# Altium schematic sheet LTC2499Test.SchDoc
size A
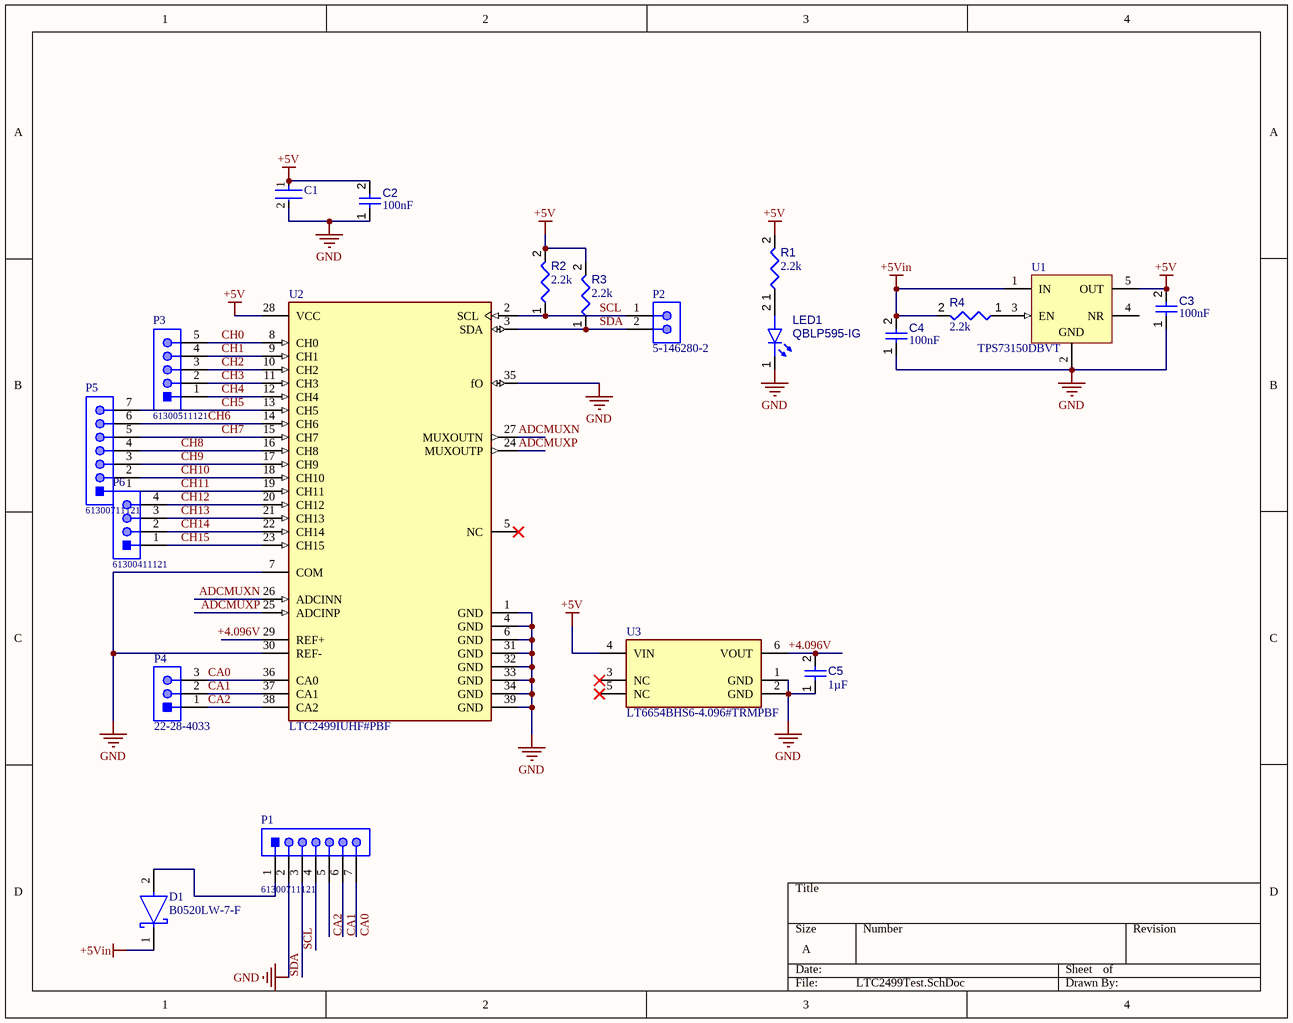
[diagram p0: LTC2499Test.SchDoc]

## Parts
C1  GRM21BR60J226ME39L  [FP-GRM21B-0_15-MFG]  (value not drawn)
C2  value 100nF  [CAPC0402(1005)60_L]  (hidden comment: Capacitor 100nF +/-20% 25V 0402)
C3  value 100nF  [CAPC0402(1005)60_L]  (hidden comment: Capacitor 100nF +/-20% 25V 0402)
C4  value 100nF  [CAPC0402(1005)60_L]  (hidden comment: Capacitor 100nF +/-20% 25V 0402)
C5  value 1µF  [CAPC1608X90X35ML15T15]  (hidden comment: Capacitor 1uF +/- 10% 16V 0603)
D1  B0520LW-7-F  [FP-SOD123-MFG]
LED1  QBLP595-IG  [QTB-QBLP595_V]
P1  61300711121  [61300711121]
P2  5-146280-2  [TECO-5-146280-2_V]
P3  61300511121  [61300511121]
P4  22-28-4033  [MOLX-22-28-4033_V]
P5  61300711121  [61300711121]
P6  61300411121  [61300411121]
R1  value 2.2k  [RESC0402(1005)_L]  (hidden comment: Resistor 2K2  +/-5 % 0402 63 mW)
R2  value 2.2k  [RESC0402(1005)_L]  (hidden comment: Resistor 2K2  +/-5 % 0402 63 mW)
R3  value 2.2k  [RESC0402(1005)_L]  (hidden comment: Resistor 2K2  +/-5 % 0402 63 mW)
R4  value 2.2k  [RESC0402(1005)_L]  (hidden comment: Resistor 2K2  +/-5 % 0402 63 mW)
U1  TPS73150DBVT  [DBV0005A_N]
U2  LTC2499IUHF#PBF  [FP-UHF-38-05-08-1701-IPC_C]
U3  LT6654BHS6-4.096#TRMPBF  [FP-S6-6-05-08-1636-IPC_B]

## Nets
+5V: C1.1 C2.2 C3.2 R1.2 R2.2 R3.2 U1.5(OUT) U2.28(VCC) U3.4(VIN)
+5Vin: C4.2 D1.1(C) R4.2 U1.1(IN)
GND: C1.2 C2.1 C3.1 C4.1 C5.1 LED1.1(K) P1.2 U1.2(GND) U2.1(GND) U2.4(GND) U2.6(GND) U2.7(COM) U2.30(REF-) U2.31(GND) U2.32(GND) U2.33(GND) U2.34(GND) U2.35(fO) U2.39(GND) U3.1(GND) U3.2(GND)
+4.096V: C5.2 U2.29(REF+) U3.6(VOUT)
ADCMUXN: U2.26(ADCINN) U2.27(MUXOUTN)
ADCMUXP: U2.24(MUXOUTP) U2.25(ADCINP)
CA0: P1.7 P4.3 U2.36(CA0)
CA1: P1.6 P4.2 U2.37(CA1)
CA2: P1.5 P4.1 U2.38(CA2)
CH0: P3.5 U2.8(CH0)
CH1: P3.4 U2.9(CH1)
CH2: P3.3 U2.10(CH2)
CH3: P3.2 U2.11(CH3)
CH4: P3.1 U2.12(CH4)
CH5: P5.7 U2.13(CH5)
CH6: P5.6 U2.14(CH6)
CH7: P5.5 U2.15(CH7)
CH8: P5.4 U2.16(CH8)
CH9: P5.3 U2.17(CH9)
CH10: P5.2 U2.18(CH10)
CH11: P5.1 U2.19(CH11)
CH12: P6.4 U2.20(CH12)
CH13: P6.3 U2.21(CH13)
CH14: P6.2 U2.22(CH14)
CH15: P6.1 U2.23(CH15)
SCL: P1.4 P2.1 R2.1 U2.2(SCL)
SDA: P1.3 P2.2 R3.1 U2.3(SDA)
NetD1_2: D1.2(A) P1.1
NetLED1_2: LED1.2(A) R1.1
NetR4_1: R4.1 U1.3(EN)

Not connected (* = marked no-connect by the designer): U1 4(NR); U2 5(NC)*; U3 3(NC)* 5(NC)*

## Library data of the parts
C1 = CMP-2007-03385-2: Chip Multilayer Ceramic Capacitors for General Purpose, 0805, 22uF, X5R, 15%, 20%, 6.3V; Material: Ceramic; Max Operating Temperature: 85°C; Voltage: 6.3V; Min Operating Temperature: -55°C; Case/Package: 0805; Thickness: 0.053inch; Dielectric: X5R; Packaging: Tape and Reel; Depth: 1.25mm; Termination: SMD/SMT; Voltage Rating (DC): 6.3V; Radiation Hardening: No; Tolerance: 20%; Mount: Surface Mount; Lead Free: Lead Free; Package Quantity: 1; REACH SVHC: No SVHC; Voltage Rating: 6.3V; Capacitance: 22uF; Length: 2mm; Case Code (Imperial): 0805; Case Code (Metric): 2012; Width: 0.049inch; Height: 1.25mm
C2-C4 = CMP-001-00065-4: Chip Capacitor, 100nF +/-20%, 25V, 0402, Thickness 0.6 mm; Tolerance: 10%; Max Operating Temperature: 85°C; Min Operating Temperature: -55°C; Pins: 2; Voltage Rating: 25V; Mounting Technology: SMT; Case/Package: 0402
C5 = CMP-001-00004-6: Chip Capacitor, 1 uF, +/- 10%, 16 V, 0603 (1608 Metric); Capacitor Type: Ceramic; Mounting Technology: SM; RoHS Compliant: True; Min Operating Temperature: -55°C; Case/Package: 0603; Pins: 2; Voltage Rating: 16V; Max Operating Temperature: 125°C; Tolerance: 10%
D1 = CMP-12790-000026-1: DIODE SCHOTTKY 20V 500MA SOD123; Manufacturer: Diodes Inc.; Max Junction Temp: +125°C; Value: 170pF; Max Surge Forward Current: 5.5A; Forward Current: 0.5A; Standoff Height: 0mm; Peak Reverse Current: 250uA; Octopart: https://octopart.com/b0520lw-7-f-diodes+inc.-325707; Mouser Description: Schottky Diodes & Rectifiers 20V 410mW; ComponentLink2Description: Datasheet; Ipc Land Pattern Name: SOD365155X123-2; Device Class L1: Discrete Semiconductors; Category: Diode; ComponentLink2URL: https://www.diodes.com/assets/Datasheets/ds30051.pdf; Footprint Url: https://www.diodes.com/assets/Package-Files/SOD123.pdf; Package: SOD123; Device Class L3: Schottky Diodes; Digikey Description: DIODE SCHOTTKY 20V 500MA SOD123; Temperature Range Low: -65°C; RoHS: TRUE; Max Repetitive Reverse Voltage: 20V; Lead Free: Yes; Temperature: -65°C to +125°C; Reverse Voltage: 20V; Temperature Range High: +125°C; Capacitance: 170pF; Device Class L2: Diodes; Automotive: No; Height: 1.45mm; Manufacturer Part Number: B0520LW-7-F
LED1 = CMP-007-00041-3: Chip LED 0402, Green, 0.02 A, 3.1 to 3.7 V, -40 to 80 degC, 2-Pin SMD, RoHS, Tape and Reel; Case/Package: 0402; Colour: Green; Mounting Technology: SMT; Pins: 2; RoHS Compliant: Yes
P1 P5 = CMP-1502-01074-1: THT Vertical Pin Header WR-PHD, Pitch 2.54 mm, Single Row, 7 pins; Manufacturer: Wurth Elektronik; Pin Number: 7; Gender: Male; Working Voltage: 250VAC; Contact Resistance: 20mOhm; Rated Current: 3A; Pitch: 2.54mm; Withstanding Voltage: 500VAC; Row Number: Single; Packaging: Bag; Orientation: Vertical; Manufacturer URL: http://www.we-online.de; Datasheet URL: https://katalog.we-online.de/em/datasheet/6130xx11121.pdf; Part Number: 61300711121; Publisher: WurthElektronik; Operating Temperature: -40to105degC; Mounting Technology: THT; Package Reference: 61300711121
P2 = CMP-2000-07492-1: Male Header, Pitch 2.54 mm, 1 x 2 Position, Height 8.21 mm, Tail Length 3.05 mm, -65 to 105 degC, RoHS, Bulk; Manufacturer: TE Connectivity; Mating Connector Lock: No(Without); Number of Positions: 2; Pitch: 2.54mm; PCB Mounting Orientation: Vertical; Keyed: No; Case\/Package: 100; Mating Post Length: 0.23inch; High Temperature Housing: Yes; Max Current Rating: 5A; PCB Thickness: 0.063inch; PCB Mount Retention: Without; Approvals: CSA; Current Rating: 3A; Radiation Hardening: No; Length: 4.67mm; Contact Mating Length: 0.23inch; Connector Type: Header; Number of Rows: 1; Termination Post Length: 0.12inch; Board Standoff: No(Without); Max Operating Temperature: 105degC; Contact Shape: Square; Selectively Loaded: No(Without); Gasket: No(Without); Number of Contacts: 2; Contact Gender: Male; Mating Alignment: No(Without); Manufacturer URL: http://www.te.com/; Datasheet URL: http://www.te.com/commerce/DocumentDelivery/DDEController?Action=showdoc&DocId=Customer+Drawing%7F146280%7FH1%7Fpdf%7FEnglish%7FENG_CD_146280_H1.pdf%7F5-146280-2; Mount: ThroughHole; Orientation: Straight; Packaging: Carton; Package Reference: 5-146280-2; Package Quantity: 500; Stabilizers: No(Without); Row Spacing: 2.54mm; Contact Material: CopperAlloy; Panel Mount Retention: No(Without); Datasheet Version: Rev. H1, 08/2016; Housing Colour: Black; Colour: Black; Package Description: Male Header, Pitch 2.54 mm, 1 x 2 Position, Height 8.21 mm, Tail Length 3.05 mm; Contact Plating: Matte; Housing Material: Polymer; Contact Protection: No(Without); Min Operating Temperature: -65degC; Mounting Technology: ThroughHole; Flammability Rating: UL94V-0; RoHSCompliant: true; Termination: ThroughHole; Depth: 2.34mm; High Speed Serial Data Connector: No
P3 = CMP-1502-01068-1: THT Vertical Pin Header WR-PHD, Pitch 2.54 mm, Single Row, 5 pins; Manufacturer: Wurth Elektronik; Pin Number: 5; Contact Resistance: 20mOhm; Working Voltage: 250VAC; Pitch: 2.54mm; Withstanding Voltage: 500VAC; Rated Current: 3A; Gender: Male; Datasheet URL: https://katalog.we-online.de/em/datasheet/6130xx11121.pdf; Orientation: Vertical; Mounting Technology: THT; Row Number: Single; Package Reference: 61300511121; Publisher: WurthElektronik; Part Number: 61300511121; Packaging: Bag; Manufacturer URL: http://www.we-online.de; Operating Temperature: -40to105degC
P4 = CMP-1676-00001-5: Male Header, Pitch 2.54 mm, 1 x 3 Position, Height 8.38 mm, Tail Length 3.18 mm, RoHS, Bulk; Manufacturer: Molex; Rows: 1; Voltage Rating: 250 V; Current Rating: 4 A; Min Operating Temperature: 0 degC; Lead Pitch: 0.1 inch; Packaging: Bulk; Contact Finish: Gold; RoHSCompliant: true; Contact Material: Brass; PackageReference: 22-28-4033; REACH SVHC: Unknown; PackageDescription: Male Header, Pitch 2.54 mm, 1 x 3 Position, Height 8.38 mm, Tail Length 3.18 mm; ComponentLink2URL: http://www.molex.com/pdm_docs/sd/022284033_sd.pdf; Height: 8.38 mm; Mounting Technology: Through Hole; ComponentLink1Description: Manufacturer URL; Length: 7.62 mm; Mount: Through Hole; DatasheetVersion: Rev. G, 01/2012; Max Operating Temperature: 75 degC; ComponentLink2Description: Datasheet; Colour: Black; Pins: 3; Contact Plating: Gold; Package Quantity: 1; ComponentLink1URL: http://www.molex.com/
P6 = CMP-1502-01064-1: THT Vertical Pin Header WR-PHD, Pitch 2.54 mm, Single Row, 4 pins; Manufacturer: Wurth Elektronik; Withstanding Voltage: 500VAC; Rated Current: 3A; Working Voltage: 250VAC; Pin Number: 4; Gender: Male; Contact Resistance: 20mOhm; Pitch: 2.54mm; Manufacturer URL: http://www.we-online.de; Operating Temperature: -40to105degC; Packaging: Bag; Mounting Technology: THT; Package Reference: 61300411121; Datasheet URL: https://katalog.we-online.de/em/datasheet/6130xx11121.pdf; Publisher: WurthElektronik; Part Number: 61300411121; Row Number: Single; Orientation: Vertical
R1-R4 = CMP-009-00166-3: Chip Resistor, 2,2 kOhms, +/-5 %, 63 mW, -55 to 155 degC, 0402; Power: 63mW; Tolerance: 5%; Pins: 2; Min Operating Temperature: -55°C; Max Operating Temperature: 155°C; Case/Package: 0402
U1 = CMP-0394-00654-2: Single Output Fast Transient Response LDO, 150 mA, Fixed 5 V Output, 1.7 to 5.5 V Input, 5-pin SOT-23 (DBV), -40 to 85 degC, Green (RoHS & no Sb/Br); Manufacturer: Texas Instruments; Vout Adj(Max)(V): 5; SubFamily: Single Channel LDO; Vdo(Typ)(mV): 30; Accuracy(%): 1; Vin(Max)(V): 5.5; Iout(Max)(A): 0.15; Vin(Min)(V): 1.7; Iq(Typ)(mA): 0.4; Eco-Plan: Green (RoHS & no Sb/Br); ComponentLink3URL: http://www.ti.com/litv/pdf/mpds018i; Code_JEDEC: MO-178; ComponentLink3Description: Package Specification; ComponentLink1Description: Manufacturer URL; ComponentLink2Description: Datasheet; PartNumber: TPS73150DBVT; ComponentLink1URL: http://www.ti.com/; PackageDescription: 5-Pin Plastic Small Outline, Body 1.60 Ãƒâ€” 2.90 mm, Pitch 0.95 mm; PackageVersion: 4073253-4/K; Vout Adj(Min)(V): 5; Mounting Technology: Surface Mount; ComponentLink2URL: http://www.ti.com/general/docs/lit/getliterature.tsp?genericPartNumber=TPS73150&fileType=pdf; PackageReference: DBV0005A; Fixed Output Options(V): 5; DatasheetVersion: SBVS034M
U2 = CMP-09081-000017-1: IC ADC 24BIT SIGMA-DELTA 38QFN; Min Supply Voltage: 2.7V; Number of Converters: 1; Interface: I2C; Polarity: Bipolar; Resolution: 24b; Sampling Rate: 7.5S/s; Supply Type: Single; Max Supply Voltage: 5.5V; Number of Bits: 24; Number of Pins: 38; RoHS Compliant: Yes; Max Operating Temperature: 85°C; Package Quantity: 52; Lead Free: Lead Free; Packaging: Rail/Tube; Case/Package: QFN; Min Operating Temperature: -40°C; Number of Elements: 1; Mount: Surface Mount
U3 = CMP-09137-000044-1: IC VREF SERIES 0.1% TSOT23-6; Max Output Voltage: 4.096V; Output Current: 10mA; Quiescent Current: 350uA; Number of Channels: 1; Temperature Coefficient: 20ppm/°C; Series: -; Max Operating Temperature: 125°C; Lead Free: Lead Free; Reference Voltage: 4.096V; Mount: Surface Mount; Output Voltage: 4.096V; Reference Type: Series; Case/Package: TSOT; RoHS Compliant: Yes; Tolerance: 0.1%; Min Operating Temperature: -40°C; Package Quantity: 1; Number of Pins: 6; REACH SVHC: No SVHC; Packaging: Tape and Reel